# EAGLE schematic dual-vco (EAGLE 9.6.2)
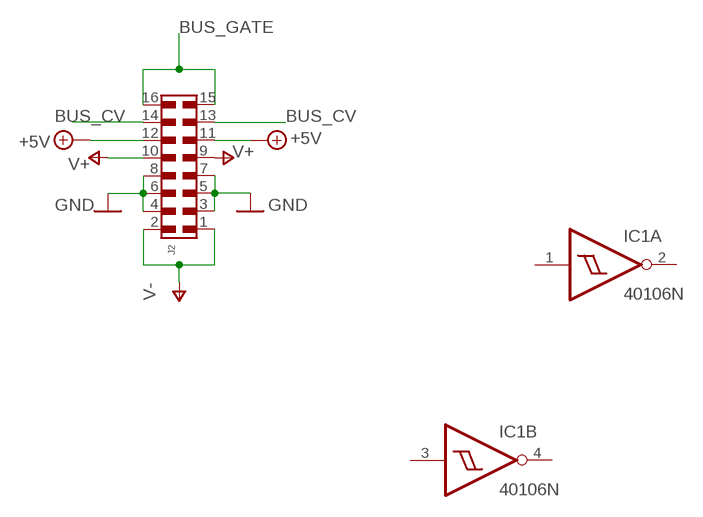
[diagram p0: schematic, sheet 1]

## Parts
IC1  40106N  [DIL14]
J2  6120XX20621_61201620621  [61201620621]

## Nets
+5V: J2.11 J2.12
BUS_CV: J2.13 J2.14
BUS_GATE: J2.15 J2.16
GND: J2.3 J2.4 J2.5 J2.6 J2.7 J2.8
V+: J2.9 J2.10
V-: J2.1 J2.2
Unconnected: IC1.1(A:I) IC1.2(A:O) IC1.3(B:I) IC1.4(B:O) IC1.5(C:I) IC1.6(C:O) IC1.8(D:O) IC1.9(D:I) IC1.10(E:O) IC1.11(E:I) IC1.12(F:O) IC1.13(F:I)

## Power pins joined to a net without a drawn wire
VDD: IC1.14(P:VDD)
VSS: IC1.7(P:VSS)

## Library data of the parts
IC1 = 40xx:40106: Hex SCHMITT TRIGGER
J2 = Wurth_Connectors_WR-BHD:6120XX20621_61201620621: WR-BHD 2.54 mm Male SMT Box Header KIND PROPERTIES: Pitch 2.54 mm Gender:Male MATERIAL PROPERTIES: Insulator Material:PA6T Insulator Flammability Rating UL94 V-0 Insulator Color:Black Contact Material :Copper Alloy Contact Plating :Gold Contact Type: Stamped GENERAL INFORMATION: Operating Temperature:-40 °C up to +125 °C Compliance:RoHS Working Voltage: 250 V (AC) Withstanding Voltage:500 V (AC) Contact Resistance: 20 mΩ Insulation Resistance:1000 MΩ CERTIFICATION: UL Approval:E323964 PACKAGING PROPERTIES Packaging :Tube <https://katalog.we-online.com/media/images/v2/o32919v209%20Family_WR-BHD_612xxx20621.jpg> Details see: https://katalog.we-online.com/en/em/BHD_2_54_SMT_MALE_BOX_HEADER_6120XX20621 Updated by Yingchun,Shan 2019-10-30 2019 (C) Würth Elektronik; CONTACT-RESISTANCE: 20mOhm; DATASHEET-URL: https://katalog.we-online.com/em/datasheet/61201620621.pdf; GENDER: Male; IR: 3A; L: 28.12mm; MOUNT: SMT; PACKAGING: Tube; PART-NUMBER: 61201620621; PINS: 16; PITCH: 2.54mm; TOL-R: max.; TYPE: Straight; WORKING-VOLTAGE: 250V(AC)